# EasyEDA schematic schematic.json
TITLE: Sheet_1; REV: 1.0; Date: 2024-10-19; Sheet: 1/1; Drawn By: MohammedMMc; Company: Your Company
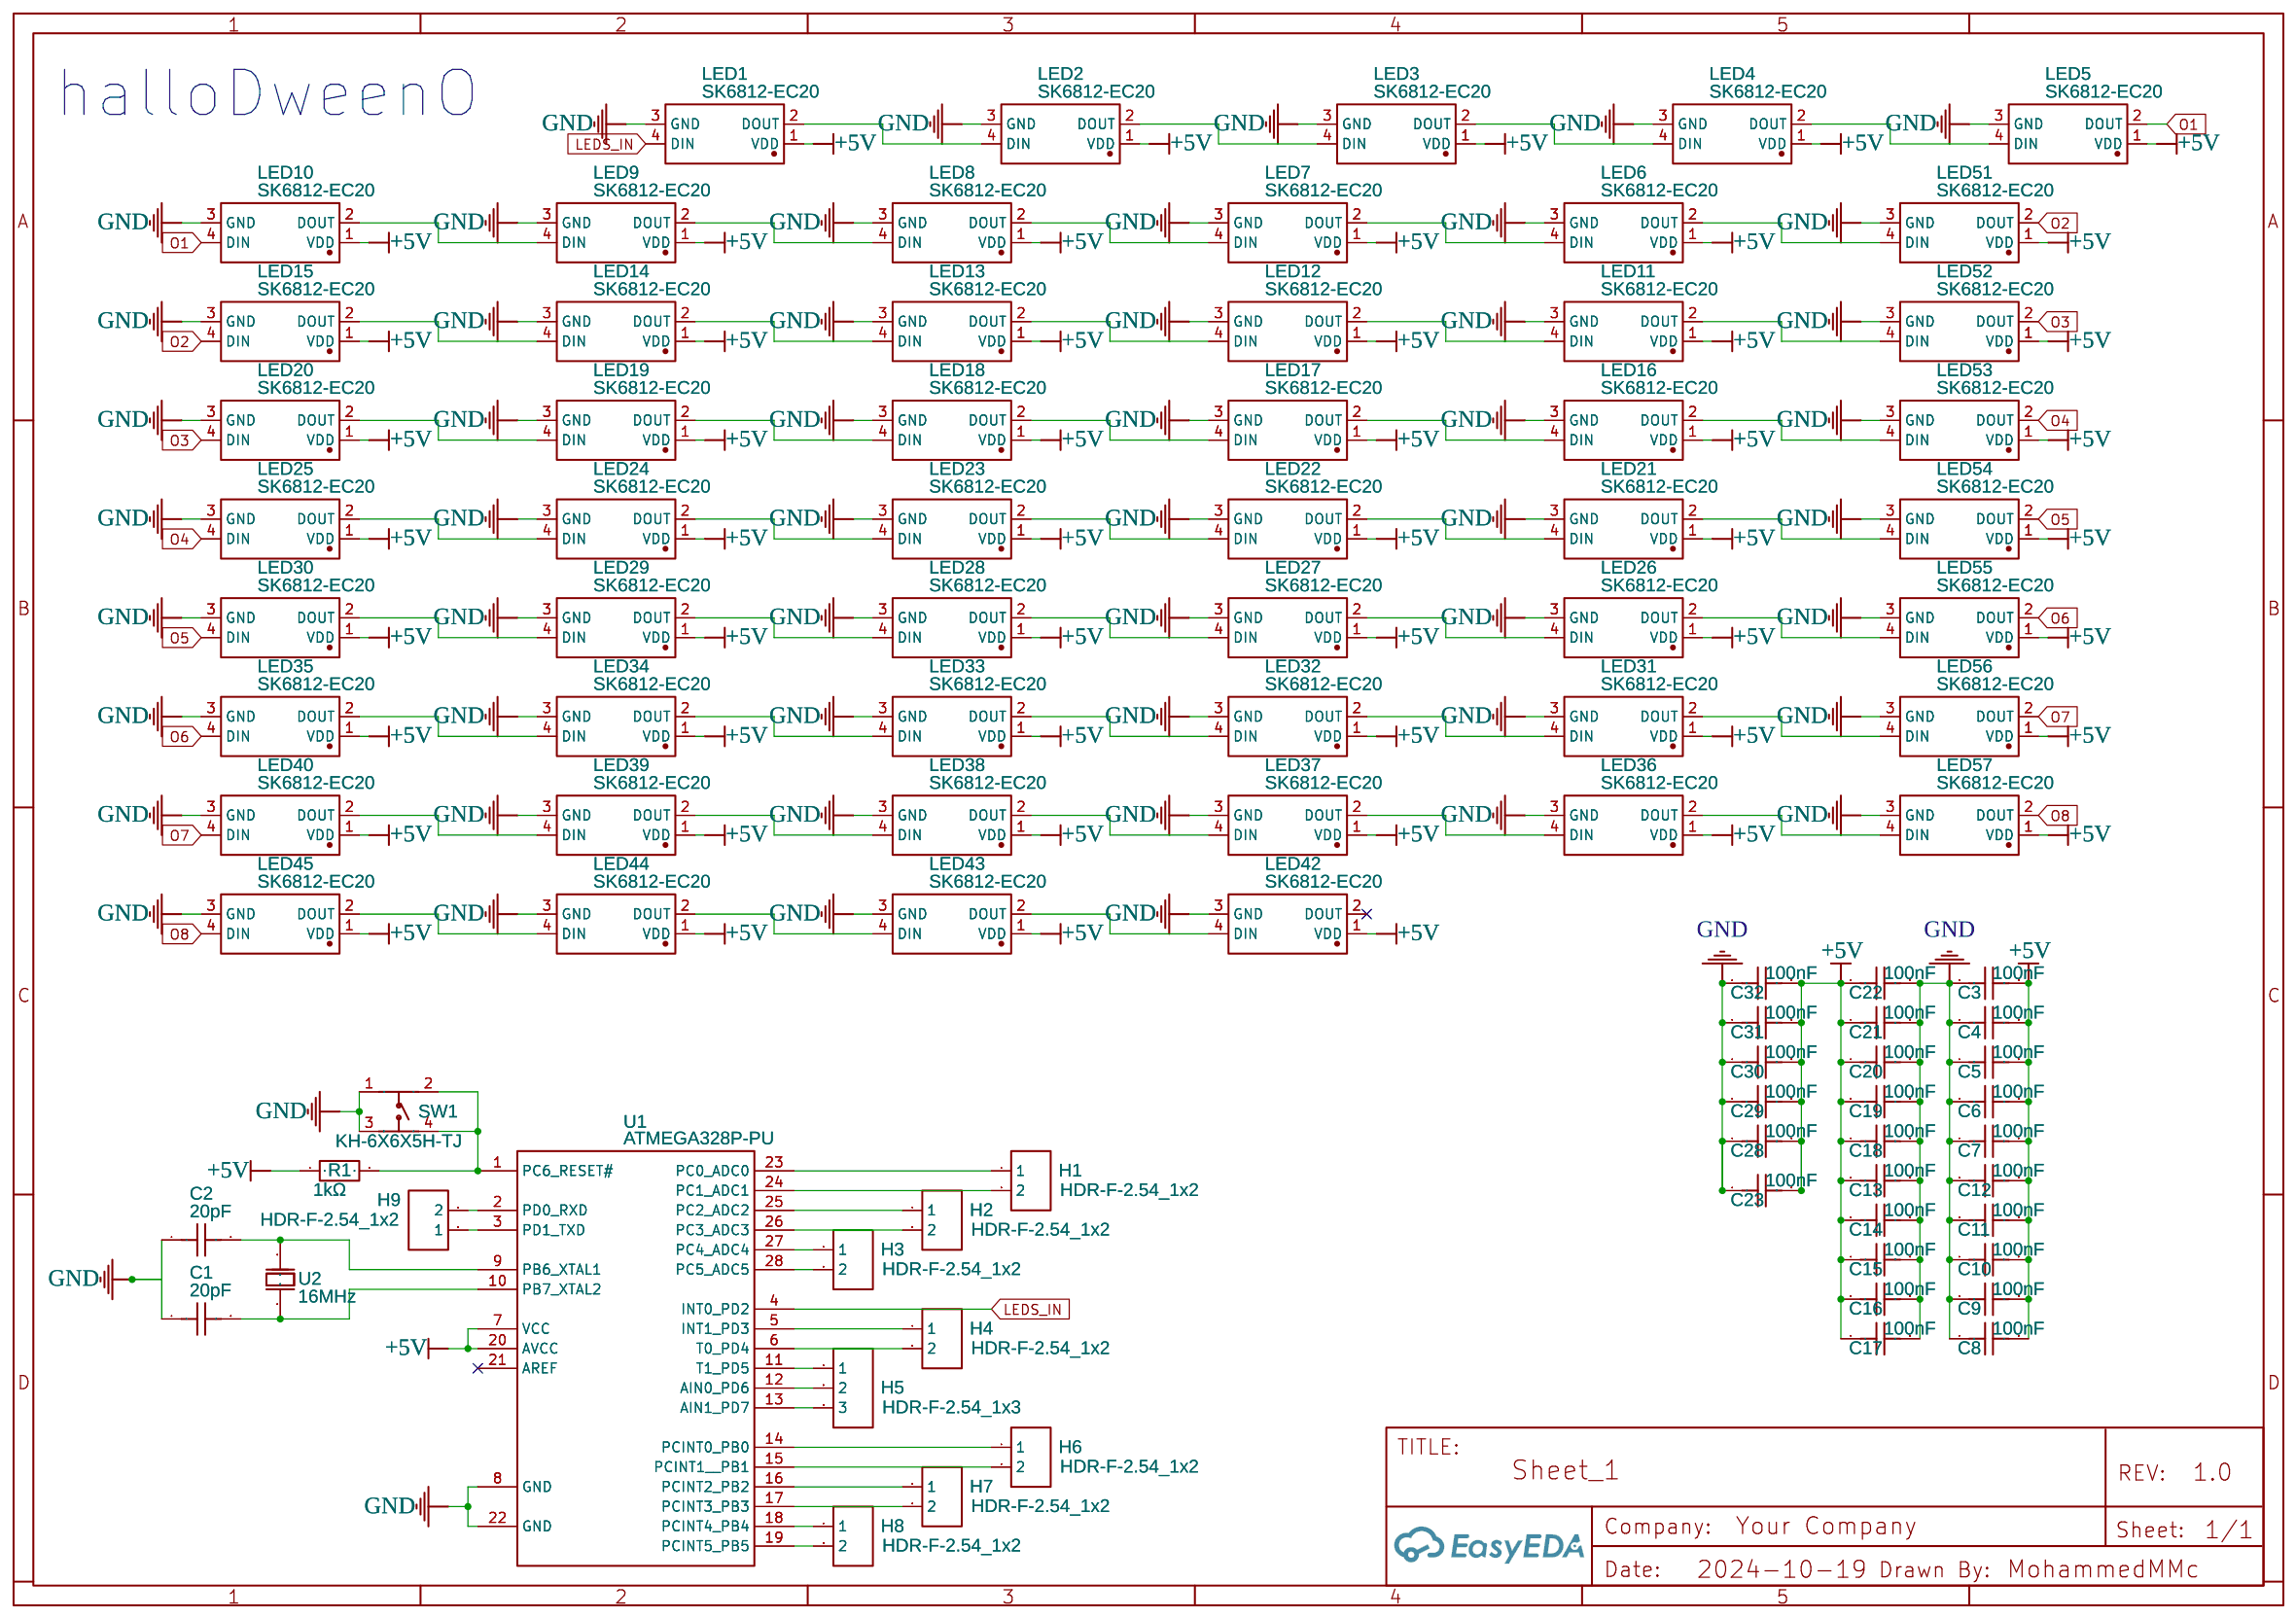
[diagram p0: schematic sheet]

## Parts
C1  20pF  [CAP-TH_L5.0-W3.0-P5.00-D1.0]
C2  20pF  [CAP-TH_L5.0-W3.0-P5.00-D1.0]
C3  100nF  [C0603]
C4  100nF  [C0603]
C5  100nF  [C0603]
C6  100nF  [C0603]
C7  100nF  [C0603]
C8  100nF  [C0603]
C9  100nF  [C0603]
C10  100nF  [C0603]
C11  100nF  [C0603]
C12  100nF  [C0603]
C13  100nF  [C0603]
C14  100nF  [C0603]
C15  100nF  [C0603]
C16  100nF  [C0603]
C17  100nF  [C0603]
C18  100nF  [C0603]
C19  100nF  [C0603]
C20  100nF  [C0603]
C21  100nF  [C0603]
C22  100nF  [C0603]
C23  100nF  [C0603]
C28  100nF  [C0603]
C29  100nF  [C0603]
C30  100nF  [C0603]
C31  100nF  [C0603]
C32  100nF  [C0603]
H1  HDR-F-2.54_1x2  [HDR-F-2.54_1X2]
H2  HDR-F-2.54_1x2  [HDR-F-2.54_1X2]
H3  HDR-F-2.54_1x2  [HDR-F-2.54_1X2]
H4  HDR-F-2.54_1x2  [HDR-F-2.54_1X2]
H5  HDR-F-2.54_1x3  [HDR-F-2.54_1X3]
H6  HDR-F-2.54_1x2  [HDR-F-2.54_1X2]
H7  HDR-F-2.54_1x2  [HDR-F-2.54_1X2]
H8  HDR-F-2.54_1x2  [HDR-F-2.54_1X2]
H9  HDR-F-2.54_1x2  [HDR-F-2.54_1X2]
LED1  SK6812-EC20  [LED-SMD_4P-L2.0-W2.0-BR]
LED2  SK6812-EC20  [LED-SMD_4P-L2.0-W2.0-BR]
LED3  SK6812-EC20  [LED-SMD_4P-L2.0-W2.0-BR]
LED4  SK6812-EC20  [LED-SMD_4P-L2.0-W2.0-BR]
LED5  SK6812-EC20  [LED-SMD_4P-L2.0-W2.0-BR]
LED6  SK6812-EC20  [LED-SMD_4P-L2.0-W2.0-BR]
LED7  SK6812-EC20  [LED-SMD_4P-L2.0-W2.0-BR]
LED8  SK6812-EC20  [LED-SMD_4P-L2.0-W2.0-BR]
LED9  SK6812-EC20  [LED-SMD_4P-L2.0-W2.0-BR]
LED10  SK6812-EC20  [LED-SMD_4P-L2.0-W2.0-BR]
LED11  SK6812-EC20  [LED-SMD_4P-L2.0-W2.0-BR]
LED12  SK6812-EC20  [LED-SMD_4P-L2.0-W2.0-BR]
LED13  SK6812-EC20  [LED-SMD_4P-L2.0-W2.0-BR]
LED14  SK6812-EC20  [LED-SMD_4P-L2.0-W2.0-BR]
LED15  SK6812-EC20  [LED-SMD_4P-L2.0-W2.0-BR]
LED16  SK6812-EC20  [LED-SMD_4P-L2.0-W2.0-BR]
LED17  SK6812-EC20  [LED-SMD_4P-L2.0-W2.0-BR]
LED18  SK6812-EC20  [LED-SMD_4P-L2.0-W2.0-BR]
LED19  SK6812-EC20  [LED-SMD_4P-L2.0-W2.0-BR]
LED20  SK6812-EC20  [LED-SMD_4P-L2.0-W2.0-BR]
LED21  SK6812-EC20  [LED-SMD_4P-L2.0-W2.0-BR]
LED22  SK6812-EC20  [LED-SMD_4P-L2.0-W2.0-BR]
LED23  SK6812-EC20  [LED-SMD_4P-L2.0-W2.0-BR]
LED24  SK6812-EC20  [LED-SMD_4P-L2.0-W2.0-BR]
LED25  SK6812-EC20  [LED-SMD_4P-L2.0-W2.0-BR]
LED26  SK6812-EC20  [LED-SMD_4P-L2.0-W2.0-BR]
LED27  SK6812-EC20  [LED-SMD_4P-L2.0-W2.0-BR]
LED28  SK6812-EC20  [LED-SMD_4P-L2.0-W2.0-BR]
LED29  SK6812-EC20  [LED-SMD_4P-L2.0-W2.0-BR]
LED30  SK6812-EC20  [LED-SMD_4P-L2.0-W2.0-BR]
LED31  SK6812-EC20  [LED-SMD_4P-L2.0-W2.0-BR]
LED32  SK6812-EC20  [LED-SMD_4P-L2.0-W2.0-BR]
LED33  SK6812-EC20  [LED-SMD_4P-L2.0-W2.0-BR]
LED34  SK6812-EC20  [LED-SMD_4P-L2.0-W2.0-BR]
LED35  SK6812-EC20  [LED-SMD_4P-L2.0-W2.0-BR]
LED36  SK6812-EC20  [LED-SMD_4P-L2.0-W2.0-BR]
LED37  SK6812-EC20  [LED-SMD_4P-L2.0-W2.0-BR]
LED38  SK6812-EC20  [LED-SMD_4P-L2.0-W2.0-BR]
LED39  SK6812-EC20  [LED-SMD_4P-L2.0-W2.0-BR]
LED40  SK6812-EC20  [LED-SMD_4P-L2.0-W2.0-BR]
LED42  SK6812-EC20  [LED-SMD_4P-L2.0-W2.0-BR]
LED43  SK6812-EC20  [LED-SMD_4P-L2.0-W2.0-BR]
LED44  SK6812-EC20  [LED-SMD_4P-L2.0-W2.0-BR]
LED45  SK6812-EC20  [LED-SMD_4P-L2.0-W2.0-BR]
LED51  SK6812-EC20  [LED-SMD_4P-L2.0-W2.0-BR]
LED52  SK6812-EC20  [LED-SMD_4P-L2.0-W2.0-BR]
LED53  SK6812-EC20  [LED-SMD_4P-L2.0-W2.0-BR]
LED54  SK6812-EC20  [LED-SMD_4P-L2.0-W2.0-BR]
LED55  SK6812-EC20  [LED-SMD_4P-L2.0-W2.0-BR]
LED56  SK6812-EC20  [LED-SMD_4P-L2.0-W2.0-BR]
LED57  SK6812-EC20  [LED-SMD_4P-L2.0-W2.0-BR]
R1  1kΩ  [RES-TH_BD2.3-L6.5-P10.50-D0.5]
SW1  KH-6X6X5H-TJ  [SW-TH_4P-L6.0-W6.0-P4.50-LS6.5]
U1  ATMEGA328P-PU  [DIP-28_L34.6-W7.3-P2.54-LS10.2-BL]
U2  16MHz  [HC-49S_L11.5-W4.7-P4.88]

## Library data of the parts
C1 C2 = DCC200J20COHF6FJ5A0: Contributor: lcsc; Supplier: LCSC; Supplier Part: C2896124; Manufacturer: SHM(南方宏明); JLCPCB Part Class: Extended Part
C3-C23 C28-C32 = CC0603KRX7R9BB104: Supplier: LCSC; Manufacturer: YAGEO(国巨); Supplier Part: C14663; JLCPCB Part Class: Basic Part
H1-H4 H6-H9 = HDR-F-2.54_1x2: Supplier Part: C49661; Supplier: LCSC; Contributor: LCEDA_Lib
H5 = HDR-F-2.54_1x3: Supplier Part: C146690; Supplier: LCSC; Contributor: LCEDA_Lib
LED1-LED40 LED42-LED45 LED51-LED57 = SK6812-EC20: Contributor: lcsc; Supplier: LCSC; Supplier Part: C2909058; Manufacturer: 欧思科光电; JLCPCB Part Class: Extended Part
R1 = MF1/4W-1KΩ±1%T52: Contributor: LCSC; Supplier: LCSC; Supplier Part: C713997; Manufacturer: 华星机电; JLCPCB Part Class: Extended Part
SW1 = KH-6X6X5H-TJ: Contributor: LCSC; Supplier: LCSC; Supplier Part: C2837515; Manufacturer: kinghelm(金航标); JLCPCB Part Class: Extended Part
U1 = ATMEGA328P-PU: sourceId: Oic6oiASL; Contributor: LCSC; Supplier: LCSC; Manufacturer: MICROCHIP(美国微芯); Supplier Part: C33901; JLCPCB Part Class: Extended Part
U2 = H1OSC-SUG-16M: Supplier: LCSC; Supplier Part: C20617530; Manufacturer: YXC(扬兴晶振); JLCPCB Part Class: Extended Part; Contributor: lcsc

## Nets
+5V: C3.2 C4.2 C5.2 C6.2 C7.2 C8.2 C9.2 C10.2 C11.2 C12.2 C13.1 C14.1 C15.1 C16.1 C17.1 C18.1 C19.1 C20.1 C21.1 C22.1 C23.2 C28.2 C29.2 C30.2 C31.2 C32.2 LED1.1(VDD) LED2.1(VDD) LED3.1(VDD) LED4.1(VDD) LED5.1(VDD) LED6.1(VDD) LED7.1(VDD) LED8.1(VDD) LED9.1(VDD) LED10.1(VDD) LED11.1(VDD) LED12.1(VDD) LED13.1(VDD) LED14.1(VDD) LED15.1(VDD) LED16.1(VDD) LED17.1(VDD) LED18.1(VDD) LED19.1(VDD) LED20.1(VDD) LED21.1(VDD) LED22.1(VDD) LED23.1(VDD) LED24.1(VDD) LED25.1(VDD) LED26.1(VDD) LED27.1(VDD) LED28.1(VDD) LED29.1(VDD) LED30.1(VDD) LED31.1(VDD) LED32.1(VDD) LED33.1(VDD) LED34.1(VDD) LED35.1(VDD) LED36.1(VDD) LED37.1(VDD) LED38.1(VDD) LED39.1(VDD) LED40.1(VDD) LED42.1(VDD) LED43.1(VDD) LED44.1(VDD) LED45.1(VDD) LED51.1(VDD) LED52.1(VDD) LED53.1(VDD) LED54.1(VDD) LED55.1(VDD) LED56.1(VDD) LED57.1(VDD) R1.1 U1.7(VCC) U1.20(AVCC)
GND: C1.1 C2.1 C3.1 C4.1 C5.1 C6.1 C7.1 C8.1 C9.1 C10.1 C11.1 C12.1 C13.2 C14.2 C15.2 C16.2 C17.2 C18.2 C19.2 C20.2 C21.2 C22.2 C23.1 C28.1 C29.1 C30.1 C31.1 C32.1 LED1.3(GND) LED2.3(GND) LED3.3(GND) LED4.3(GND) LED5.3(GND) LED6.3(GND) LED7.3(GND) LED8.3(GND) LED9.3(GND) LED10.3(GND) LED11.3(GND) LED12.3(GND) LED13.3(GND) LED14.3(GND) LED15.3(GND) LED16.3(GND) LED17.3(GND) LED18.3(GND) LED19.3(GND) LED20.3(GND) LED21.3(GND) LED22.3(GND) LED23.3(GND) LED24.3(GND) LED25.3(GND) LED26.3(GND) LED27.3(GND) LED28.3(GND) LED29.3(GND) LED30.3(GND) LED31.3(GND) LED32.3(GND) LED33.3(GND) LED34.3(GND) LED35.3(GND) LED36.3(GND) LED37.3(GND) LED38.3(GND) LED39.3(GND) LED40.3(GND) LED42.3(GND) LED43.3(GND) LED44.3(GND) LED45.3(GND) LED51.3(GND) LED52.3(GND) LED53.3(GND) LED54.3(GND) LED55.3(GND) LED56.3(GND) LED57.3(GND) SW1.1 SW1.3 U1.8(GND) U1.22(GND)
LEDS_IN: LED1.4(DIN) U1.4(INT0 PD2)
O1: LED5.2(DOUT) LED10.4(DIN)
O2: LED15.4(DIN) LED51.2(DOUT)
O3: LED20.4(DIN) LED52.2(DOUT)
O4: LED25.4(DIN) LED53.2(DOUT)
O5: LED30.4(DIN) LED54.2(DOUT)
O6: LED35.4(DIN) LED55.2(DOUT)
O7: LED40.4(DIN) LED56.2(DOUT)
O8: LED45.4(DIN) LED57.2(DOUT)
Net-(C1-2): C1.2 U1.10(PB7 XTAL2) U2.1(OSC1)
Net-(C2-2): C2.2 U1.9(PB6 XTAL1) U2.2(OSC2)
Net-(H1-1): H1.1 U1.23(PC0 ADC0)
Net-(H1-2): H1.2 U1.24(PC1 ADC1)
Net-(H2-1): H2.1 U1.25(PC2 ADC2)
Net-(H2-2): H2.2 U1.26(PC3 ADC3)
Net-(H3-1): H3.1 U1.27(PC4 ADC4)
Net-(H3-2): H3.2 U1.28(PC5 ADC5)
Net-(H4-1): H4.1 U1.5(INT1 PD3)
Net-(H4-2): H4.2 U1.6(T0 PD4)
Net-(H5-1): H5.1 U1.11(T1 PD5)
Net-(H5-2): H5.2 U1.12(AIN0 PD6)
Net-(H5-3): H5.3 U1.13(AIN1 PD7)
Net-(H6-1): H6.1 U1.14(PCINT0 PB0)
Net-(H6-2): H6.2 U1.15(PCINT1  PB1)
Net-(H7-1): H7.1 U1.16(PCINT2 PB2)
Net-(H7-2): H7.2 U1.17(PCINT3 PB3)
Net-(H8-1): H8.1 U1.18(PCINT4 PB4)
Net-(H8-2): H8.2 U1.19(PCINT5 PB5)
Net-(H9-1): H9.1 U1.3(PD1 TXD)
Net-(H9-2): H9.2 U1.2(PD0 RXD)
Net-(LED1-2): LED1.2(DOUT) LED2.4(DIN)
Net-(LED2-2): LED2.2(DOUT) LED3.4(DIN)
Net-(LED3-2): LED3.2(DOUT) LED4.4(DIN)
Net-(LED4-2): LED4.2(DOUT) LED5.4(DIN)
Net-(LED6-2): LED6.2(DOUT) LED51.4(DIN)
Net-(LED6-4): LED6.4(DIN) LED7.2(DOUT)
Net-(LED7-4): LED7.4(DIN) LED8.2(DOUT)
Net-(LED8-4): LED8.4(DIN) LED9.2(DOUT)
Net-(LED9-4): LED9.4(DIN) LED10.2(DOUT)
Net-(LED11-2): LED11.2(DOUT) LED52.4(DIN)
Net-(LED11-4): LED11.4(DIN) LED12.2(DOUT)
Net-(LED12-4): LED12.4(DIN) LED13.2(DOUT)
Net-(LED13-4): LED13.4(DIN) LED14.2(DOUT)
Net-(LED14-4): LED14.4(DIN) LED15.2(DOUT)
Net-(LED16-2): LED16.2(DOUT) LED53.4(DIN)
Net-(LED16-4): LED16.4(DIN) LED17.2(DOUT)
Net-(LED17-4): LED17.4(DIN) LED18.2(DOUT)
Net-(LED18-4): LED18.4(DIN) LED19.2(DOUT)
Net-(LED19-4): LED19.4(DIN) LED20.2(DOUT)
Net-(LED21-2): LED21.2(DOUT) LED54.4(DIN)
Net-(LED21-4): LED21.4(DIN) LED22.2(DOUT)
Net-(LED22-4): LED22.4(DIN) LED23.2(DOUT)
Net-(LED23-4): LED23.4(DIN) LED24.2(DOUT)
Net-(LED24-4): LED24.4(DIN) LED25.2(DOUT)
Net-(LED26-2): LED26.2(DOUT) LED55.4(DIN)
Net-(LED26-4): LED26.4(DIN) LED27.2(DOUT)
Net-(LED27-4): LED27.4(DIN) LED28.2(DOUT)
Net-(LED28-4): LED28.4(DIN) LED29.2(DOUT)
Net-(LED29-4): LED29.4(DIN) LED30.2(DOUT)
Net-(LED31-2): LED31.2(DOUT) LED56.4(DIN)
Net-(LED31-4): LED31.4(DIN) LED32.2(DOUT)
Net-(LED32-4): LED32.4(DIN) LED33.2(DOUT)
Net-(LED33-4): LED33.4(DIN) LED34.2(DOUT)
Net-(LED34-4): LED34.4(DIN) LED35.2(DOUT)
Net-(LED36-2): LED36.2(DOUT) LED57.4(DIN)
Net-(LED36-4): LED36.4(DIN) LED37.2(DOUT)
Net-(LED37-4): LED37.4(DIN) LED38.2(DOUT)
Net-(LED38-4): LED38.4(DIN) LED39.2(DOUT)
Net-(LED39-4): LED39.4(DIN) LED40.2(DOUT)
Net-(LED42-4): LED42.4(DIN) LED43.2(DOUT)
Net-(LED43-4): LED43.4(DIN) LED44.2(DOUT)
Net-(LED44-4): LED44.4(DIN) LED45.2(DOUT)
Net-(R1-2): R1.2 SW1.2 SW1.4 U1.1(PC6 RESET#)

Not connected (* = marked no-connect by the designer): LED42 2(DOUT)*; U1 21(AREF)*

## Notes on the sheet
- halloDweenO
